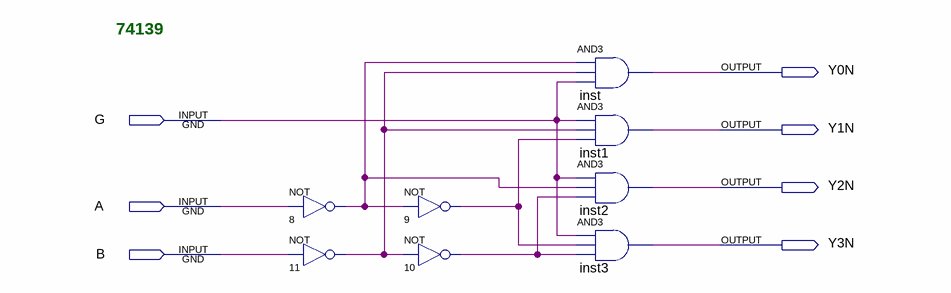
[diagram p0: schematic sheet]
// Quartus schematic dec2-4.bdf as structural Verilog: 8 symbols, 7 pins
module \dec2-4  (
  input  G,
  input  A,
  input  B,
  output Y0N,
  output Y1N,
  output Y2N,
  output Y3N
);

  wire n8_out, n9_out, n10_out, n11_out;

  not u_8 (n8_out, A);
  not u_11 (n11_out, B);
  not u_9 (n9_out, n8_out);
  not u_10 (n10_out, n11_out);
  and inst (Y0N, n8_out, n11_out, G);
  and inst1 (Y1N, G, n11_out, n9_out);
  and inst2 (Y2N, G, n8_out, n10_out);
  and inst3 (Y3N, G, n9_out, n10_out);

  // Notes on the sheet:
  //   74139
endmodule
